# EAGLE schematic Pull_Up:Down_Resistors (EAGLE 8.6.1)
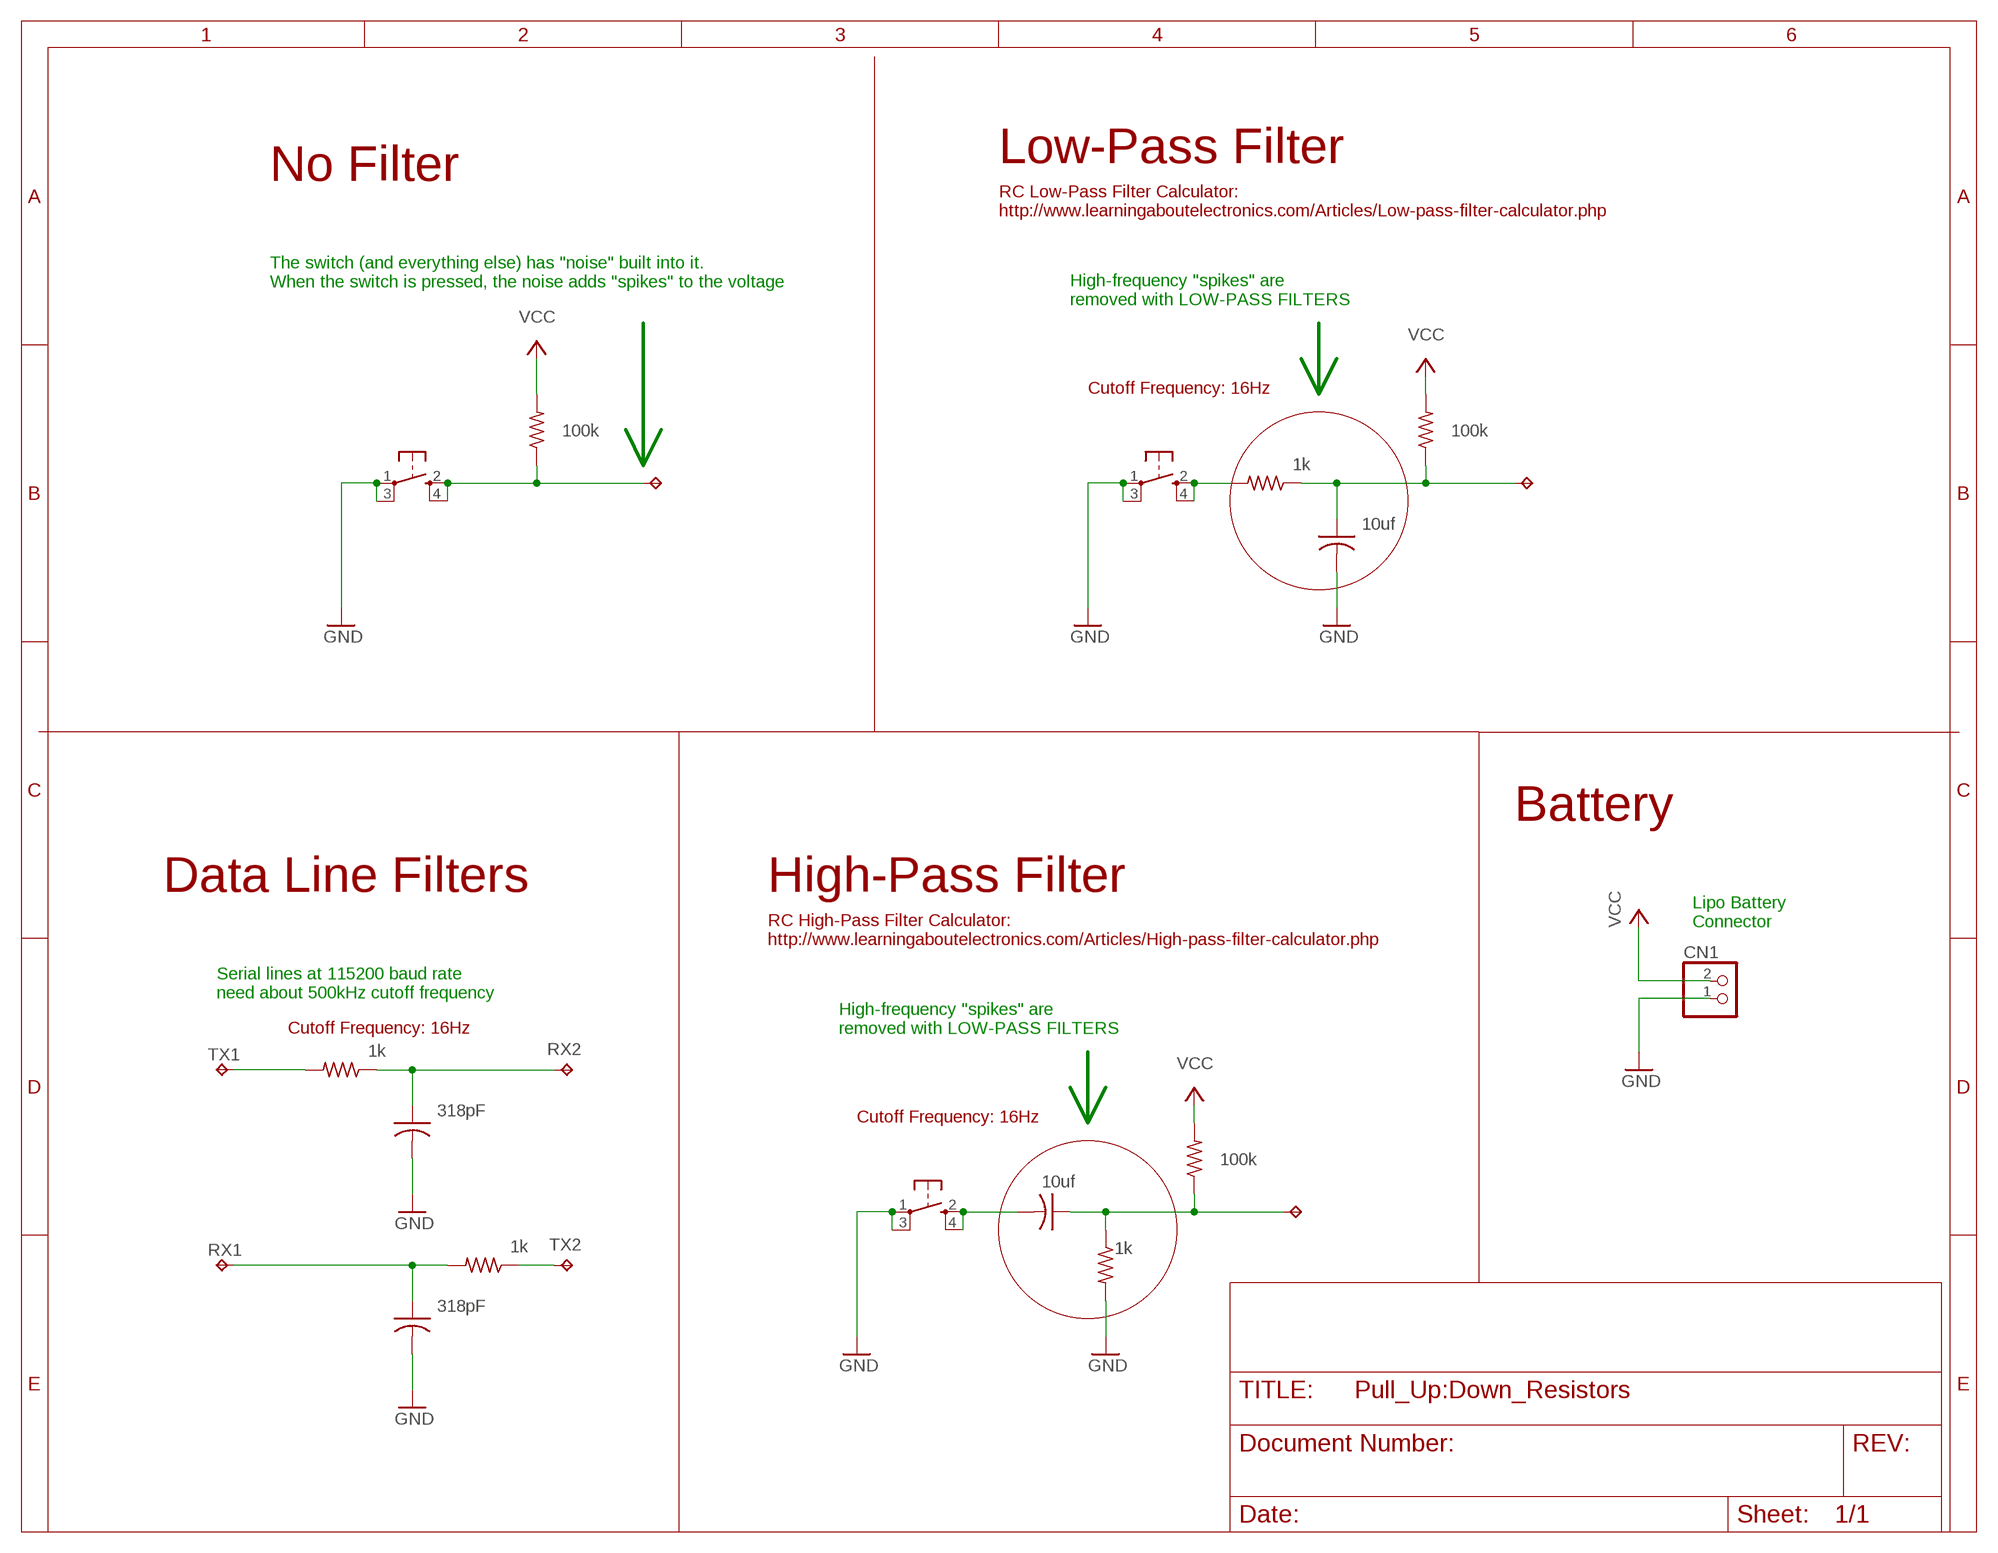
[diagram p0: schematic, sheet 1]

## Parts
C1  10uf  C-USC0603  [C0603]
C2  318pF  C-USC0603  [C0603]
C3  318pF  C-USC0603  [C0603]
C4  10uf  C-USC0603  [C0603]
CN1  JST_2PIN-SMT-RA  [JST-PH-2-SMT-RA]
R1  100k  R-US_R0603  [R0603]
R2  100k  R-US_R0603  [R0603]
R3  1k  R-US_R0603  [R0603]
R4  1k  R-US_R0603  [R0603]
R5  1k  R-US_R0603  [R0603]
R6  100k  R-US_R0603  [R0603]
R7  1k  R-US_R0603  [R0603]
RX1  TPTP20R  [TP20R]
RX2  TPTP20R  [TP20R]
SW1  SPST_TACT-KMR2  [KMR2]
SW2  SPST_TACT-KMR2  [KMR2]
SW3  SPST_TACT-KMR2  [KMR2]
TP1  TPTP20R  [TP20R]
TP2  TPTP20R  [TP20R]
TP3  TPTP20R  [TP20R]
TX1  TPTP20R  [TP20R]
TX2  TPTP20R  [TP20R]

## Nets
GND: C1.2 C2.2 C3.2 CN1.1 R7.2 SW1.1(P) SW1.3(P1) SW2.1(P) SW2.3(P1) SW3.1(P) SW3.3(P1)
N$1: R1.1 SW3.2(S) SW3.4(S1) TP3.TP
N$3: C1.1 R2.1 R3.1 TP1.TP
N$4: R3.2 SW1.2(S) SW1.4(S1)
N$6: C2.1 R5.1 RX2.TP
N$7: R5.2 TX1.TP
N$8: C3.1 R4.2 RX1.TP
N$9: R4.1 TX2.TP
N$10: C4.1 R6.1 R7.1 TP2.TP
N$11: C4.2 SW2.2(S) SW2.4(S1)
VCC: CN1.2 R1.2 R2.2 R6.2

## Notes on the sheet
- Low-Pass Filter
- No Filter
- RC Low-Pass Filter Calculator:
  http://www.learningaboutelectronics.com/Articles/Low-pass-filter-calculator.php
- The switch (and everything else) has "noise" built into it.
  When the switch is pressed, the noise adds "spikes" to the voltage
- High-frequency "spikes" are
  removed with LOW-PASS FILTERS
- Cutoff Frequency: 16Hz
- Battery
- Data Line Filters | High-Pass Filter
- Lipo Battery
  Connector
- RC High-Pass Filter Calculator:
  http://www.learningaboutelectronics.com/Articles/High-pass-filter-calculator.php
- Serial lines at 115200 baud rate
  need about 500kHz cutoff frequency
- Cutoff Frequency: 16Hz
- High-frequency "spikes" are
  removed with LOW-PASS FILTERS
- Cutoff Frequency: 16Hz

## Library data of the parts
C1-C4 = adafruit:C-US: CAPACITOR, American symbol
CN1 = adafruit:JST_2PIN: JST 2-Pin Connectors of various flavors SMT-RA (S2B-PH-SM4) 4UConnector #17311 SMT (B2B-PH-SM4) THM-RA (S2B-PH) THM (B2B-PH)
R1-R7 = adafruit:R-US_: RESISTOR, American symbol
RX1 RX2 TP1-TP3 TX1 TX2 = testpad:TP: Test pad
SW1-SW3 = adafruit:SPST_TACT: SMT 6mm switch, EVQQ2 series http://www.ladyada.net/library/eagle